# Altium schematic sheet STM32F103&407VET6.SchDoc
size 203 x 203 mm
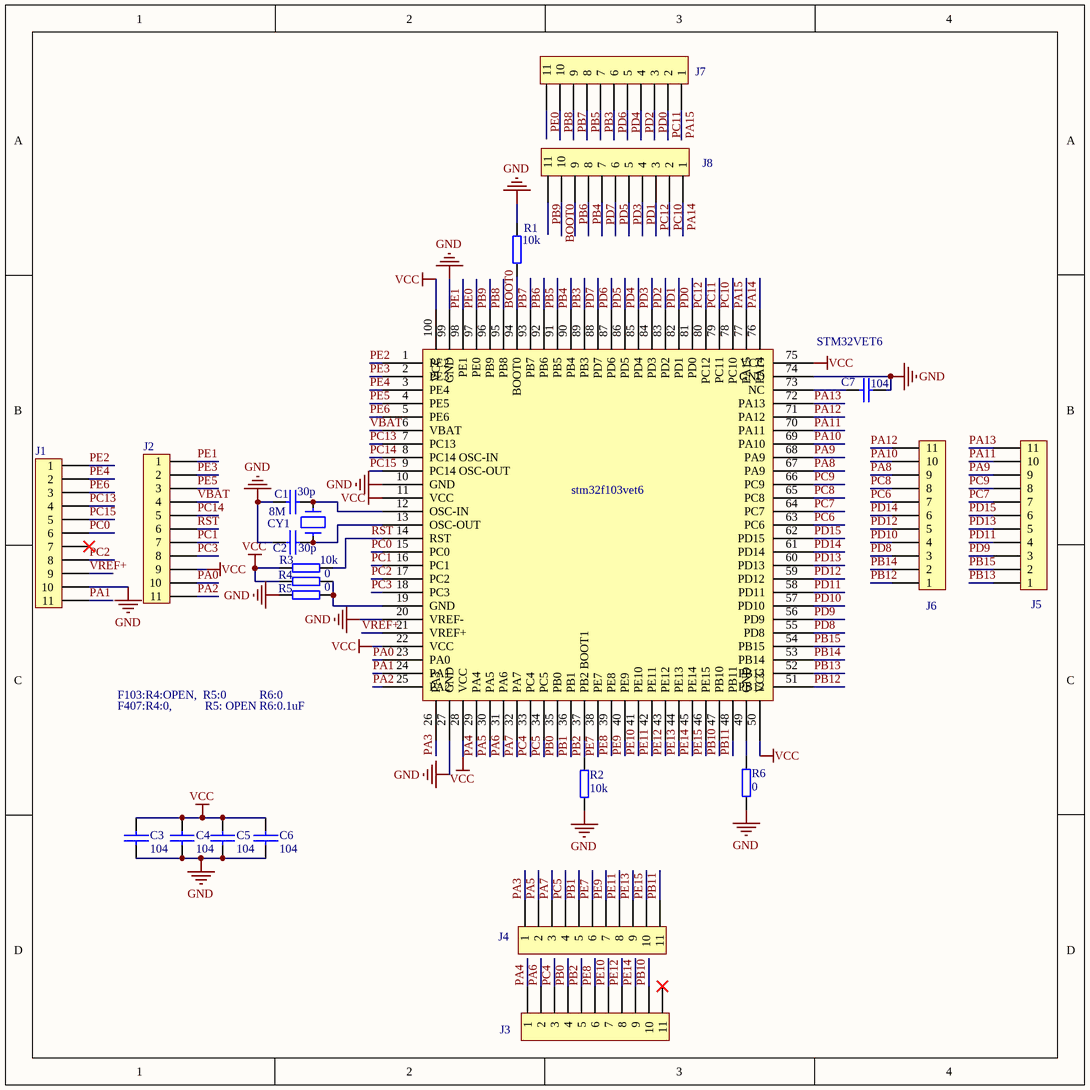
[diagram p0: STM32F103&407VET6.SchDoc]

## Parts
C1  30p  [0805]
C2  30p  [0805]
C3  104  [0805]
C4  104  [0805]
C5  104  [0805]
C6  104  [0805]
C7  104  [0805]
CY1  8M  [CY1]
J1  CON11  [SIP11]  (value not drawn)
J2  CON11  [SIP11]  (value not drawn)
J3  CON11  [SIP11]  (value not drawn)
J4  CON11  [SIP11]  (value not drawn)
J5  CON11  [SIP11]  (value not drawn)
J6  CON11  [SIP11]  (value not drawn)
J7  CON11  [SIP11]  (value not drawn)
J8  CON11  [SIP11]  (value not drawn)
R1  10k  [0805]
R2  10k  [0805]
R3  10k  [0805]
R4  0  [0805]
R5  0  [0805]
R6  0  [0805]
STM32VET6  Component_1  [TQFP100]  (value not drawn)

## Nets
GND: C1.2 C2.2 C3.1 C4.2 C5.2 C6.2 C7.1 J1.10 R1.2 R2.1 R5.2 R6.2 STM32VET6.10(GND) STM32VET6.20(VREF-) STM32VET6.27(GND) STM32VET6.74(GND) STM32VET6.99(GND)
VCC: C3.2 C4.1 C5.1 C6.1 J2.9 R3.2 R4.2 STM32VET6.11(VCC) STM32VET6.22(VCC) STM32VET6.28(VCC) STM32VET6.50(VCC) STM32VET6.75(VCC) STM32VET6.100(VCC)
BOOT0: J8.10 R1.1 STM32VET6.94(BOOT0)
PA0: J2.10 STM32VET6.23(PA0)
PA1: J1.11 STM32VET6.24(PA1)
PA2: J2.11 STM32VET6.25(PA2)
PA3: J4.1 STM32VET6.26(PA3)
PA4: J3.1 STM32VET6.29(PA4)
PA5: J4.2 STM32VET6.30(PA5)
PA6: J3.2 STM32VET6.31(PA6)
PA7: J4.3 STM32VET6.32(PA7)
PA8: J6.9 STM32VET6.67(PA9)
PA9: J5.9 STM32VET6.68(PA9)
PA10: J6.10 STM32VET6.69(PA10)
PA11: J5.10 STM32VET6.70(PA11)
PA12: J6.11 STM32VET6.71(PA12)
PA13: J5.11 STM32VET6.72(PA13)
PA14: J8.1 STM32VET6.76(PA14)
PA15: J7.1 STM32VET6.77(PA15)
PB0: J3.4 STM32VET6.35(PB0)
PB1: J4.5 STM32VET6.36(PB1)
PB2: J3.5 R2.2 STM32VET6.37(PB2_BOOT1)
PB3: J7.7 STM32VET6.89(PB3)
PB4: J8.8 STM32VET6.90(PB4)
PB5: J7.8 STM32VET6.91(PB5)
PB6: J8.9 STM32VET6.92(PB6)
PB7: J7.9 STM32VET6.93(PB7)
PB8: J7.10 STM32VET6.95(PB8)
PB9: J8.11 STM32VET6.96(PB9)
PB10: J3.10 STM32VET6.47(PB10)
PB11: J4.11 STM32VET6.48(PB11)
PB12: J6.1 STM32VET6.51(PB12)
PB13: J5.1 STM32VET6.52(PB13)
PB14: J6.2 STM32VET6.53(PB14)
PB15: J5.2 STM32VET6.54(PB15)
PC0: J1.6 STM32VET6.15(PC0)
PC1: J2.7 STM32VET6.16(PC1)
PC2: J1.8 STM32VET6.17(PC2)
PC3: J2.8 STM32VET6.18(PC3)
PC4: J3.3 STM32VET6.33(PC4)
PC5: J4.4 STM32VET6.34(PC5)
PC6: J6.7 STM32VET6.63(PC6)
PC7: J5.7 STM32VET6.64(PC7)
PC8: J6.8 STM32VET6.65(PC8)
PC9: J5.8 STM32VET6.66(PC9)
PC10: J8.2 STM32VET6.78(PC10)
PC11: J7.2 STM32VET6.79(PC11)
PC12: J8.3 STM32VET6.80(PC12)
PC13: J1.4 STM32VET6.7(PC13)
PC14: J2.5 STM32VET6.8(PC14_OSC-IN)
PC15: J1.5 STM32VET6.9(PC14_OSC-OUT)
PD0: J7.3 STM32VET6.81(PD0)
PD1: J8.4 STM32VET6.82(PD1)
PD2: J7.4 STM32VET6.83(PD2)
PD3: J8.5 STM32VET6.84(PD3)
PD4: J7.5 STM32VET6.85(PD4)
PD5: J8.6 STM32VET6.86(PD5)
PD6: J7.6 STM32VET6.87(PD6)
PD7: J8.7 STM32VET6.88(PD7)
PD8: J6.3 STM32VET6.55(PD8)
PD9: J5.3 STM32VET6.56(PD9)
PD10: J6.4 STM32VET6.57(PD10)
PD11: J5.4 STM32VET6.58(PD11)
PD12: J6.5 STM32VET6.59(PD12)
PD13: J5.5 STM32VET6.60(PD13)
PD14: J6.6 STM32VET6.61(PD14)
PD15: J5.6 STM32VET6.62(PD15)
PE0: J7.11 STM32VET6.97(PE0)
PE1: J2.1 STM32VET6.98(PE1)
PE2: J1.1 STM32VET6.1(PE2)
PE3: J2.2 STM32VET6.2(PE3)
PE4: J1.2 STM32VET6.3(PE4)
PE5: J2.3 STM32VET6.4(PE5)
PE6: J1.3 STM32VET6.5(PE6)
PE7: J4.6 STM32VET6.38(PE7)
PE8: J3.6 STM32VET6.39(PE8)
PE9: J4.7 STM32VET6.40(PE9)
PE10: J3.7 STM32VET6.41(PE10)
PE11: J4.8 STM32VET6.42(PE11)
PE12: J3.8 STM32VET6.43(PE12)
PE13: J4.9 STM32VET6.44(PE13)
PE14: J3.9 STM32VET6.45(PE14)
PE15: J4.10 STM32VET6.46(PE15)
RST: J2.6 R3.1 STM32VET6.14(RST)
VBAT: J2.4 STM32VET6.6(VBAT)
VREF+: J1.9 STM32VET6.21(VREF+)
NetC1_1: C1.1 CY1.2 STM32VET6.12(OSC-IN)
NetC2_1: C2.1 CY1.1 STM32VET6.13(OSC-OUT)
NetC7_2: C7.2 STM32VET6.73(NC)
NetR4_1: R4.1 R5.1 STM32VET6.19(GND)
NetR6_1: R6.1 STM32VET6.49(GND)

Not connected (* = marked no-connect by the designer): J1 7*; J3 11*

## Notes on the sheet
- F103:R4:OPEN,  R5:0           R6:0
- F407:R4:0,           R5: OPEN R6:0.1uF
- (in symbol Component_1) stm32f103vet6

## Library data of the parts
C1-C7 = C1: 0.1: *; 0.01: *; 0.47: *; 0.22: *; 0.022: *; 2.2n: *; 1n: *
CY1 = CY1
R1-R6 = R1